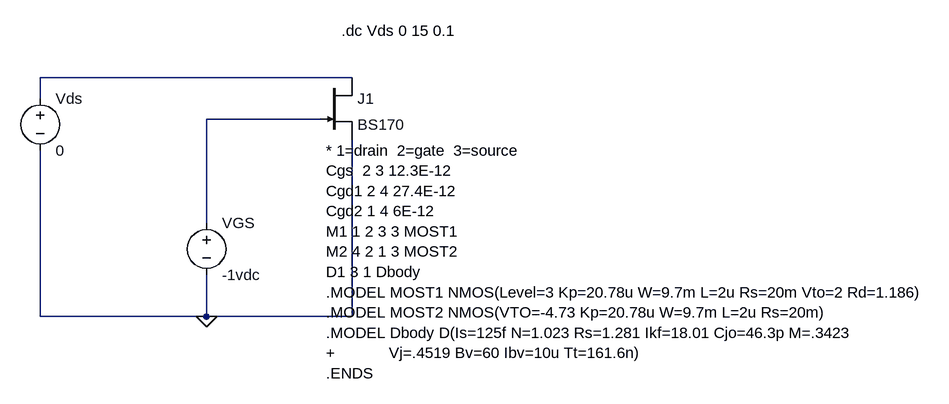
[diagram p0: schematic Draft1.asc]
Draft1.asc, the LTspice schematic file:
Version 4
SHEET 1 1460 680
WIRE 496 240 16 240
WIRE 16 272 16 240
WIRE 448 304 272 304
WIRE 272 464 272 304
WIRE 16 608 16 352
WIRE 272 608 272 544
WIRE 272 608 16 608
WIRE 496 608 496 336
WIRE 496 608 272 608
FLAG 272 608 0
SYMBOL voltage 16 256 R0
SYMATTR InstName Vds
SYMATTR Value 0
SYMBOL voltage 272 448 R0
SYMATTR InstName VGS
SYMATTR Value -1vdc
SYMBOL njf 448 240 R0
SYMATTR InstName J1
SYMATTR Value BS170
TEXT 456 352 Left 2 !* 1=drain  2=gate  3=source\nCgs  2 3 12.3E-12\nCgd1 2 4 27.4E-12\nCgd2 1 4 6E-12\nM1 1 2 3 3 MOST1\nM2 4 2 1 3 MOST2\nD1 3 1 Dbody\n.MODEL MOST1 NMOS(Level=3 Kp=20.78u W=9.7m L=2u Rs=20m Vto=2 Rd=1.186)\n.MODEL MOST2 NMOS(VTO=-4.73 Kp=20.78u W=9.7m L=2u Rs=20m)\n.MODEL Dbody D(Is=125f N=1.023 Rs=1.281 Ikf=18.01 Cjo=46.3p M=.3423\n+            Vj=.4519 Bv=60 Ibv=10u Tt=161.6n)\n.ENDS
TEXT 480 168 Left 2 !.dc Vds 0 15 0.1

The netlist it stands for:
* Draft1.asc
Vds N001 0 0
VGS N002 0 -1vdc
J1 N001 N002 0 BS170
.model NJF NJF
.model PJF PJF
.lib standard.jft
* 1=drain  2=gate  3=source
Cgs  2 3 12.3E-12
Cgd1 2 4 27.4E-12
Cgd2 1 4 6E-12
M1 1 2 3 3 MOST1
M2 4 2 1 3 MOST2
D1 3 1 Dbody
.MODEL MOST1 NMOS(Level=3 Kp=20.78u W=9.7m L=2u Rs=20m Vto=2 Rd=1.186)
.MODEL MOST2 NMOS(VTO=-4.73 Kp=20.78u W=9.7m L=2u Rs=20m)
.MODEL Dbody D(Is=125f N=1.023 Rs=1.281 Ikf=18.01 Cjo=46.3p M=.3423
+            Vj=.4519 Bv=60 Ibv=10u Tt=161.6n)
.ENDS
.dc Vds 0 15 0.1
.backanno
.end